# EAGLE design psnoise (EAGLE 7.7.0)
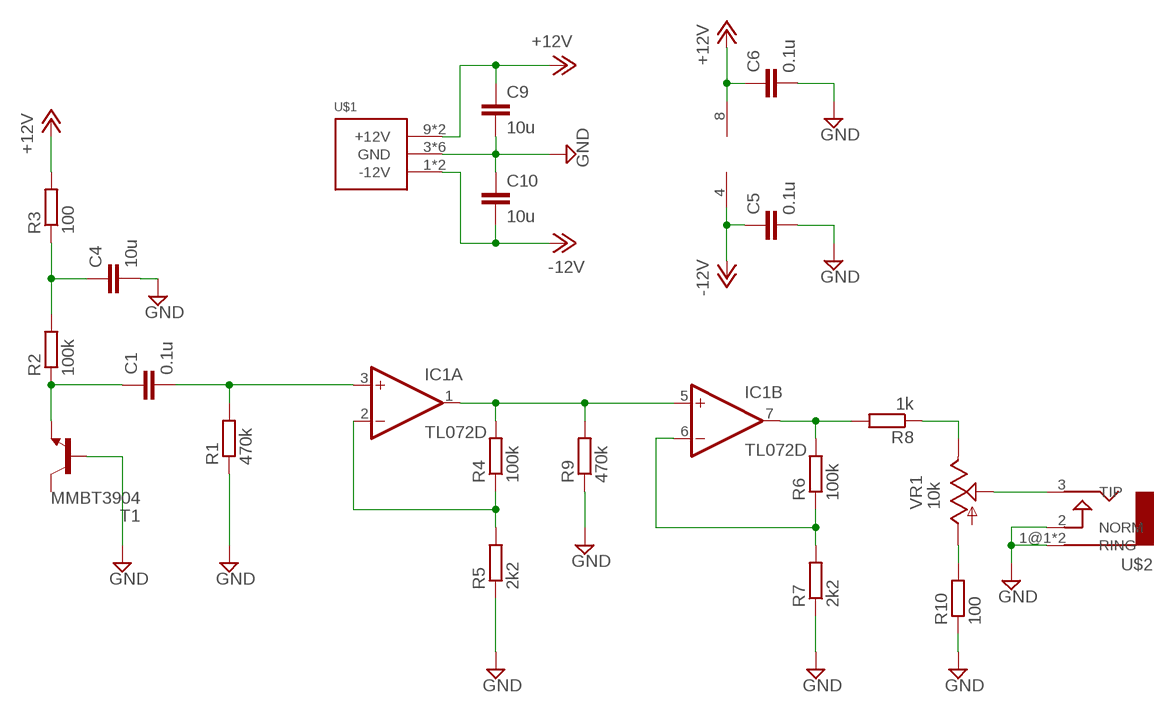
[diagram p0: schematic, sheet 1]

## Parts
C1  0.1u  C-EUC0805  [C0805]
C4  10u  C-EUC0805  [C0805]
C5  0.1u  C-EUC0805  [C0805]
C6  0.1u  C-EUC0805  [C0805]
C9  10u  C-EUC0805  [C0805]
C10  10u  C-EUC0805  [C0805]
IC1  TL072D  [SO08]
R1  470k  R-EU_R0805  [R0805]
R2  100k  R-EU_R0805  [R0805]
R3  100  R-EU_R0805  [R0805]
R4  100k  R-EU_R0805  [R0805]
R5  2k2  R-EU_R0805  [R0805]
R6  100k  R-EU_R0805  [R0805]
R7  2k2  R-EU_R0805  [R0805]
R8  1k  R-EU_R0805  [R0805]
R9  470k  R-EU_R0805  [R0805]
R10  100  R-EU_R0805  [R0805]
T1  MMBT3904  MMBT3904LT1-NPN-SOT23-BEC  [SOT23-BEC]
U$1  POWER_SIMPLE10  [POWER_10]
U$2  AUDIO-JACKERTHENVAR  [ERTHENVAR-JACK]
VR1  10k  9MM_SNAP-IN_POT_  [9MM_SNAP-IN_POT]

## Nets
+12V: C6.1 C9.1 IC1.8(P:V+) R3.2 U$1.9(+12V) U$1.10(+12V)
-12V: C5.1 C10.2 IC1.4(P:V-) U$1.1(-12V) U$1.2(-12V)
GND: C4.2 C5.2 C6.2 C9.2 C10.1 R1.1 R5.1 R7.1 R9.1 R10.1 T1.B U$1.3(GND) U$1.4(GND) U$1.5(GND) U$1.6(GND) U$1.7(GND) U$1.8(GND) U$2.1@1(RING) U$2.1@2(RING) U$2.2(NORM)
N$1: IC1.2(A:-IN) R4.1 R5.2
N$2: IC1.1(A:OUT) IC1.5(B:+IN) R4.2 R9.2
N$3: R10.2 VR1.1(A)
N$4: IC1.6(B:-IN) R6.1 R7.2
N$5: IC1.7(B:OUT) R6.2 R8.2
N$6: R8.1 VR1.3(E)
N$9: C1.2 IC1.3(A:+IN) R1.2
N$10: U$2.3(TIP) VR1.2(S)
N$11: C4.1 R2.2 R3.1
N$13: C1.1 R2.1 T1.E
Unconnected: T1.C

## Library data of the parts
C1 C4-C6 C9 C10 = rcl:C-EU: CAPACITOR, European symbol
IC1 = linear:TL072: OP AMP
R1-R10 = rcl:R-EU_: RESISTOR, European symbol
T1 = transistor:*-NPN-: NPN Transistror BF959 corrected 2008.03.06
U$1 = eurorack:POWER_SIMPLE
U$2 = erthenvar:AUDIO-JACK: Switching Mono 3.5mm Audio Jack from Erthenvar.
VR1 = MusicThingModular:9MM_SNAP-IN_POT: 9mm vertical snap-in pot, Alpha / Panasonic style

## Board
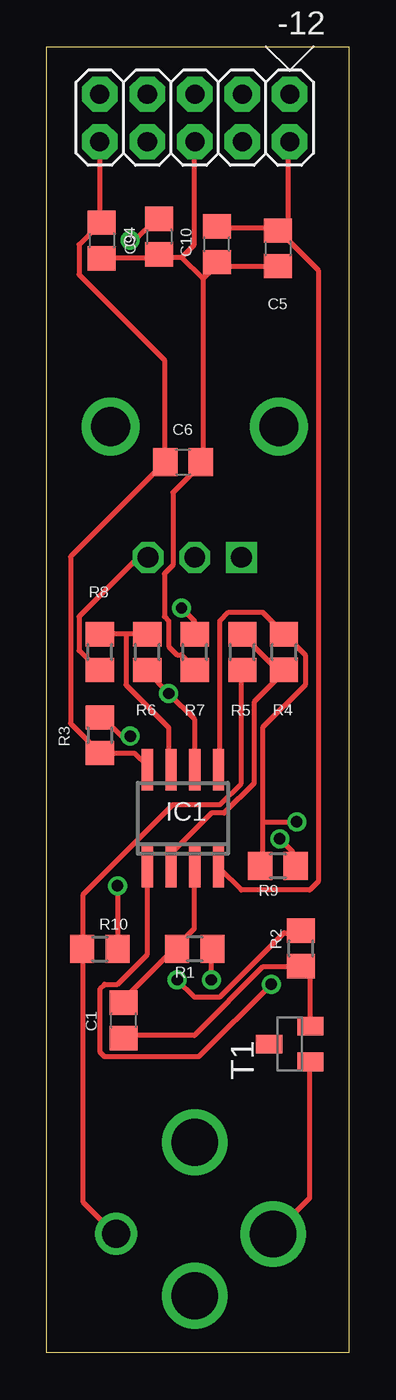
[diagram p1: board, top side]
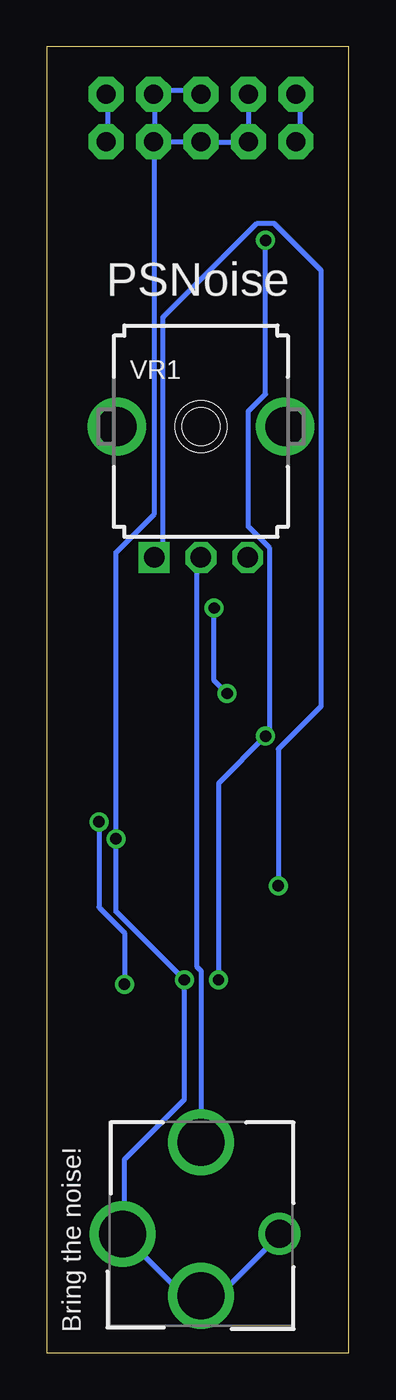
[diagram p2: board, bottom side, seen from below]

Size 16.18 x 69.84 mm. Coordinates in mm from the lower left corner, seen from the top.
Outline: 16.18,0 0,0 0,69.84 16.18,69.84 16.18,0
Copper layers (1*16): Top 0.035mm / dielectric 1.5mm / Bottom 0.035mm
Design rules "default": minimum track width 10mil, minimum drill 24mil, track to track 8mil, track to pad 8mil, pad to pad 8mil, via to via 8mil, smd to smd 8mil, copper to edge 40mil, drill to drill 8mil, minimum pad ring 10mil, minimum via ring 8mil, stop-mask expansion 4mil, vias tented up to drill 0mil, thermal gap 10mil

### Footprints (pad centres in the part's own frame; a part is rotated, then mirrored left to right if it is on the bottom)
C0805 = smd 1.3 x 1.5: 1 -0.95,0; 2 0.95,0
SO08 = smd 0.6 x 2.2: 1 -1.905,-2.6; 2 -0.635,-2.6; 3 0.635,-2.6; 4 1.905,-2.6; 5 1.905,2.6; 6 0.635,2.6; 7 -0.635,2.6; 8 -1.905,2.6
R0805 = smd 1.3 x 1.5: 1 -0.95,0; 2 0.95,0
SOT23-BEC = smd 1 x 1.4: B -0.95,-1.1; C 0,1.1; E 0.95,-1.1
POWER_10 = drill 1.016 pad 1.88 octagon: 1 -5.08,-1.27; 2 -5.08,1.27; 3 -2.54,-1.27; 4 -2.54,1.27; 5 0,-1.27; 6 0,1.27; 7 2.54,-1.27; 8 2.54,1.27; 9 5.08,-1.27; 10 5.08,1.27
ERTHENVAR-JACK = drill 2.5: 1@1 -4.2,0; 2 0,-3.3; 3 0,4.9 | drill 1.5: 1@2 4.2,0
9MM_SNAP-IN_POT = drill 1.1 square: 1 -2.5,-7 | drill 1.1 octagon: 2 0,-7; 3 2.5,-7 | drill 2.1 pad 2.794: CHASSIS1 -4.5,0; CHASSIS2 4.5,0

### Placement (x,y rotation side)
C1  4.11,17.78 90 top
C4  6.02,59.69 270 top
C5  12.37,59.05 270 top
C6  7.29,47.62 0 top
C9  2.95,59.48 270 top
C10  9.1,59.27 90 top
IC1  7.29,28.57 0 top
R1  7.92,21.59 180 top
R2  13.6,21.62 90 top
R3  2.84,33.02 270 top
R4  12.7,37.47 90 top
R5  10.46,37.46 90 top
R6  5.38,37.46 90 top
R7  7.92,37.46 90 top
R8  2.84,37.46 90 top
R9  12.37,26.03 180 top
R10  2.84,21.59 0 top
T1  13,16.51 90 top
U$1  7.92,66.04 180 top
U$2  7.92,6.35 0 bottom
VR1  7.92,49.53 0 bottom

### Tracks (layer width: path | path; a pad name or v marks a point on that pad's centre or on a via)
+12V
  Top 0.254: IC1.8 5.39,31.37 4.7,32.05 2.87,32.05 R3.2 2.64,32.28 1.27,33.66 1.27,42.57 6.3,47.6 C6.1 6.3,47.83 6.3,53.09 1.73,57.66 1.73,59.26 2.87,60.4 C9.1 2.87,60.63 2.87,64.75 U$1.10
  Bottom 0.254: U$1.10 2.64,64.97 2.64,67.26 U$1.9
-12V
  Top 0.254: C5.1 12.24,60.17 9.27,60.17 C10.2 | IC1.4 9.27,25.88 10.41,24.74 14.07,24.74 14.53,25.2 14.53,57.89 12.47,59.94 C5.1 | U$1.2 12.93,64.75 12.93,60.63 12.47,60.17 C5.1
  Bottom 0.254: U$1.2 12.93,64.97 12.93,67.26 U$1.1
GND  (via drill 0.61)
  Top 0.254: C9.2 3.1,58.57 5.84,58.57 C4.2 6.07,58.57 7.21,58.57 | C5.2 12.24,58.12 9.27,58.12 C10.1 9.04,58.12 8.36,57.43 | 8.36,57.43 8.36,47.83 C6.2 8.36,47.6 6.76,46 6.76,42.11 6.3,41.66 6.3,39.37 6.53,39.14 6.53,37.77 6.99,37.31 7.21,37.31 7.9,36.63 R7.1 | 8.36,57.43 7.21,58.57 | 7.21,58.57 7.9,59.26 7.9,64.75 U$1.6 | T1.B 14.07,15.37 14.07,8.28 12.24,6.45 U$2.1@1 | v8.81,19.94 8.81,21.54 R1.1 | v12.47,27.48 13.16,26.8 13.16,26.11 R9.1 | U$2.1@2 3.56,6.45 1.96,8.05 1.96,21.54 R10.1 1.96,21.77 1.96,24.51 6.76,29.31 9.27,29.31 10.41,30.45 10.41,36.4 R5.1
  Bottom 0.254: U$1.7 U$1.8 5.39,64.75 7.9,64.75 U$1.6 8.13,64.75 10.41,64.75 | U$1.5 8.13,67.49 10.41,67.49 U$1.3 10.41,67.26 10.41,64.97 U$1.4 10.41,64.75 | U$2.1@2 3.79,6.22 6.76,3.25 7.9,3.25 U$2.2 8.13,3.25 9.04,3.25 12.01,6.22 U$2.1@1 12.01,6.45 12.01,10.34 8.81,13.54 v8.81,19.94 12.47,23.6 v12.47,27.48 12.47,42.8 10.41,44.86 10.41,64.75
N$1
  Top 0.254: R5.2 10.64,38.23 12.24,36.63 12.7,36.63 R4.1 12.7,36.4 11.1,34.8 11.1,30.45 9.5,28.85 8.81,28.85 6.76,26.8 6.76,26.11 IC1.2
N$2  (via drill 0.61)
  Top 0.254: IC1.5 9.27,31.37 9.27,39.14 9.73,39.6 11.56,39.6 12.7,38.46 R4.2 12.93,38.23 13.84,37.31 13.84,35.71 11.56,33.43 11.56,28.4 | 11.56,28.4 11.56,26.11 R9.2 | IC1.1 5.39,21.31 3.79,19.71 3.1,19.71 2.87,19.48 2.87,16.05 3.1,15.82 8.13,15.82 v12.01,19.71 | 11.56,28.4 v13.39,28.4
  Bottom 0.254: v12.01,19.71 12.01,22.45 13.39,23.83 v13.39,28.4
N$3  (via drill 0.61)
  Top 0.254: v3.79,24.97 3.79,21.77 R10.2
  Bottom 0.254: v3.79,24.97 3.79,32.28 1.5,34.57 1.5,57.89 4.01,60.4 4.93,60.4 9.96,55.37 9.96,43.03 10.41,42.57 VR1.1
N$4  (via drill 0.61)
  Top 0.254: v7.21,39.83 7.9,39.14 7.9,38.46 R7.2 | R6.1 5.39,36.4 v6.53,35.25 7.9,33.88 7.9,31.37 IC1.6
  Bottom 0.254: v7.21,39.83 7.21,35.94 v6.53,35.25
N$5
  Top 0.254: 4.24,38.46 2.87,38.46 R8.2 | 4.24,38.46 5.39,38.46 R6.2 | 4.24,38.46 4.24,35.71 6.53,33.43 6.53,31.37 IC1.7
N$6
  Top 0.254: R8.1 2.64,36.63 1.73,37.54 1.73,39.37 4.7,42.34 5.39,42.34 VR1.3
N$9
  Top 0.254: C1.2 4.01,18.8 6.76,21.54 R1.2 6.99,21.77 7.9,22.68 7.9,25.88 IC1.3
N$10
  Bottom 0.254: VR1.2 8.13,42.34 8.13,20.62 7.9,20.4 7.9,11.25 U$2.3
N$11  (via drill 0.61)
  Top 0.254: v6.99,19.94 7.9,19.02 9.27,19.02 12.7,22.45 13.39,22.45 R2.2 | v4.47,32.97 4.01,32.97 2.87,34.11 R3.1 | v4.47,59.49 4.7,59.49 5.84,60.63 C4.1
  Bottom 0.254: v6.99,19.94 6.99,30.45 v4.47,32.97 4.24,33.2 4.24,43.03 5.39,44.17 5.39,50.34 4.47,51.26 v4.47,59.49
N$13
  Top 0.254: T1.E 14.07,17.65 14.07,20.17 13.61,20.62 R2.1 13.39,20.62 11.56,20.62 7.9,16.97 4.24,16.97 C1.1

### Text on the board
bNames: PSNoise | Bring the noise!